# Altium schematic sheet Schema_Attiny_composant.SchDoc
size A4; SheetNumber: 1; SheetTotal: 3
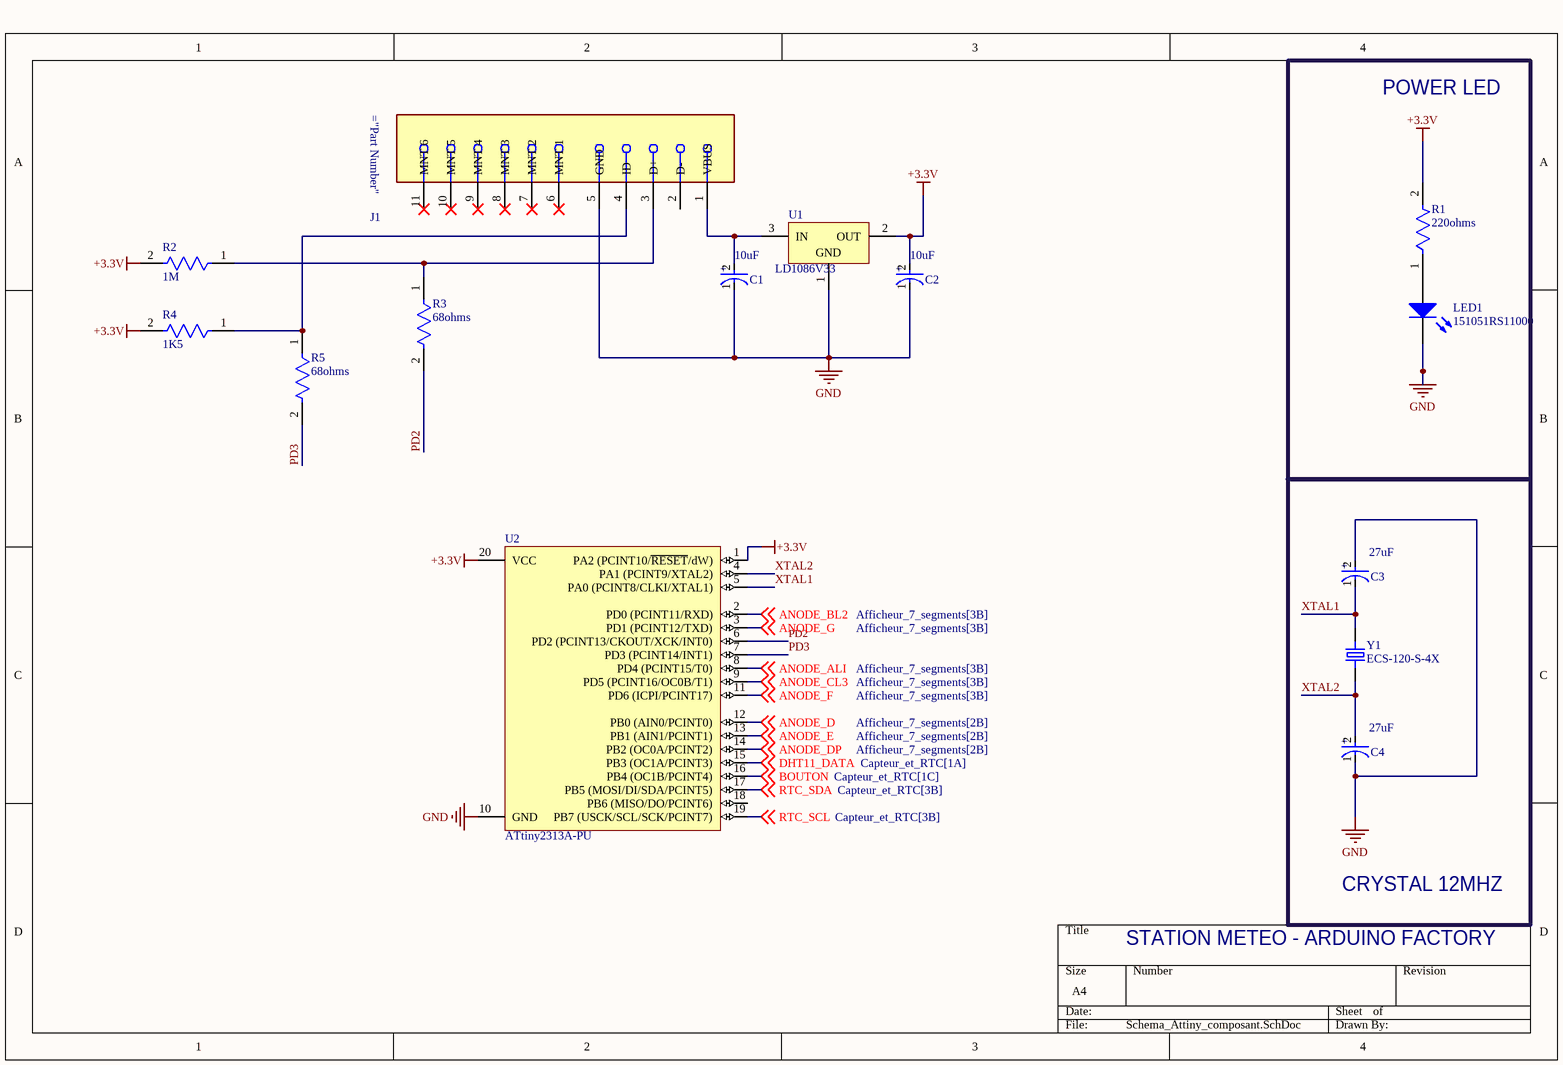
[diagram p0: Schema_Attiny_composant.SchDoc]

## Parts
C1  10uF  [Rubycon_0_MFG]
C2  10uF  [Rubycon_0_MFG]
C3  27uF  [Rubycon_0_MFG]
C4  27uF  [Rubycon_0_MFG]
J1  105164-0001  [Molex_105164-0001_0]  (value not drawn)
LED1  151051RS11000  [Type 5mm]
R1  220ohms  [Stackpole_Electronics_Inc._CF14JT1K00_0]
R2  1M  [Stackpole_Electronics_Inc._CF14JT1K00_0]
R3  68ohms  [Stackpole_Electronics_Inc._CF14JT1K00_0]
R4  1K5  [Stackpole_Electronics_Inc._CF14JT1K00_0]
R5  68ohms  [Stackpole_Electronics_Inc._CF14JT1K00_0]
U1  LD1086V33  [TO220]
U2  ATtiny2313A-PU  [20P3]
Y1  ECS-120-S-4X  [XTAL_ECS-120-S-4X]

## Blocks framed on the sheet
POWER LED: LED1 R1
CRYSTAL 12MHZ: C3 C4 Y1

## Nets
+3.3V: C2.2(A) R1.2 R2.2 R4.2 U1.2(OUT) U2.1(PA2_(PCINT10/~{RESET}/dW)) U2.20(VCC)
GND: C1.1(C) C2.1(C) C3.2(A) C4.1(C) J1.5(GND) LED1.1(K) U1.1(GND) U2.10(GND)
ANODE_ALI: U2.8(PD4_(PCINT15/T0)) ; off-sheet ANODE_ALI
ANODE_BL2: U2.2(PD0_(PCINT11/RXD)) ; off-sheet ANODE_BL2
ANODE_CL3: U2.9(PD5_(PCINT16/OC0B/T1)) ; off-sheet ANODE_CL3
ANODE_D: U2.12(PB0_(AIN0/PCINT0)) ; off-sheet ANODE_D
ANODE_DP: U2.14(PB2_(OC0A/PCINT2)) ; off-sheet ANODE_DP
ANODE_E: U2.13(PB1_(AIN1/PCINT1)) ; off-sheet ANODE_E
ANODE_F: U2.11(PD6_(ICPI/PCINT17)) ; off-sheet ANODE_F
ANODE_G: U2.3(PD1_(PCINT12/TXD)) ; off-sheet ANODE_G
BOUTON: U2.16(PB4_(OC1B/PCINT4)) ; off-sheet BOUTON
DHT11_DATA: U2.15(PB3_(OC1A/PCINT3)) ; off-sheet DHT11_DATA
PD2: R3.2 U2.6(PD2_(PCINT13/CKOUT/XCK/INT0))
PD3: R5.2 U2.7(PD3_(PCINT14/INT1))
RTC_SCL: U2.19(PB7_(USCK/SCL/SCK/PCINT7)) ; off-sheet RTC_SCL
RTC_SDA: U2.17(PB5_(MOSI/DI/SDA/PCINT5)) ; off-sheet RTC_SDA
XTAL1: C3.1(C) U2.5(PA0_(PCINT8/CLKI/XTAL1)) Y1.2
XTAL2: C4.2(A) U2.4(PA1_(PCINT9/XTAL2)) Y1.1
NetC1_2: C1.2(A) J1.1(VBUS) U1.3(IN)
NetJ1_3: J1.3(D+) R2.1 R3.1
NetJ1_4: J1.4(ID) R4.1 R5.1
NetLED1_2: LED1.2(A) R1.1

Not connected (* = marked no-connect by the designer): J1 2(D-) 6(MNT_1)* 7(MNT_2)* 8(MNT_3)* 9(MNT_4)* 10(MNT_5)* 11(MNT_6)*; U2 18(PB6_(MISO/DO/PCINT6))

## Notes on the sheet
- STATION METEO - ARDUINO FACTORY
- (in symbol 35ZLH100MEFC6_3X11) +

## Library data of the parts
C1-C4 = 35ZLH100MEFC6_3X11
LED1 = 151051RS11000: THT LED round mono-color color lens, WL-TMRW, Red; Manufacturer: Wuerth Elektronik; ComponentLink1Description: Manufacturer URL; ComponentLink2Description: Datasheet; ComponentLink1URL: http://www.we-online.com; ComponentLink2URL: http://katalog.we-online.de/pbs/datasheet/7448042001.pdfhttp://katalog.we-online.de/pbs/datasheet/7448042001.pdfhttp://katalog.we-online.de/pbs/datasheet/7448042001.pdfhttp://katalog.we-online.de/pbs/datasheet/151051RS11000.pdf; Emitting color: Red; PartNumber: 151051RS11000; PackageReference: Type 5mm
R1-R5 = MF0207FTE52-10K
U1 = LD1086V33: 1.5A, Low Drop Positive Voltage Regulator, 3.3V, 3-Pin TO-220; ComponentLink1Description: Manufacturer URL; ComponentLink2Description: Datasheet; ComponentLink3Description: Package Specification; ComponentLink3URL: http://www.st.com/internet/com/TECHNICAL_RESOURCES/TECHNICAL_LITERATURE/PACKAGE_INFORMATION/CD00004649.pdf; DatasheetVersion: 11/07/2011; ComponentLink1URL: http://www.st.com; PackageVersion: ver3.0; PackageDescription: TO, Thru-Hole, Vertical, Heatsink Mounted; 3 In-Line Leads; Pitch 2.54 mm; ComponentLink2URL: http://www.st.com/internet/com/TECHNICAL_RESOURCES/TECHNICAL_LITERATURE/DATASHEET/CD00001884.pdf; PackageReference: TO220; PartNumber: LD1086V33
U2 = ATTINY2313A-PU: 8-bit AVR Microcontroller, 1.8-5.5V, 2KB Flash, 128 Bytes EEPROM, 128 Bytes SRAM, 20-pin PDIP, Industrial Grade (-40°C to 85°C), Pb-Free; Code_JEDEC: MS-001-AD; PackageVersion: revC, Jan-2004; DatasheetVersion: revA, Dec-2009; PackageDescription: 20-lead (0.300"/7.62mm Wide) Plastic Dual Inline Package (PDIP); PackageReference: 20P3; PartNumber: ATTINY2313A-PU
Y1 = ECS-120-S-4X: CRYSTAL T/H; Package: None; Price: None; Value: *; MP: ECS-120-S-4X; Availability: Unavailable